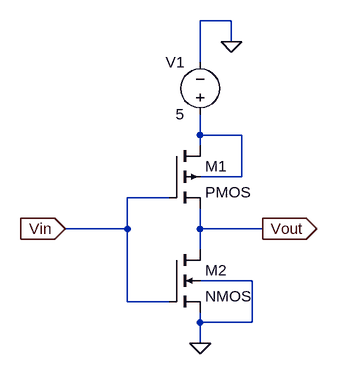
[diagram p0: schematic NotGate.asc]
NotGate.asc, the LTspice schematic file:
Version 4
SHEET 1 880 680
WIRE 224 -112 176 -112
WIRE 224 -80 224 -112
WIRE 176 -48 176 -112
WIRE 176 64 176 32
WIRE 240 64 176 64
WIRE 176 80 176 64
WIRE 240 128 240 64
WIRE 240 128 176 128
WIRE 128 160 64 160
WIRE 64 208 -32 208
WIRE 64 208 64 160
WIRE 176 208 176 176
WIRE 272 208 176 208
WIRE 176 240 176 208
WIRE 256 288 176 288
WIRE 64 320 64 208
WIRE 128 320 64 320
WIRE 176 352 176 336
WIRE 256 352 256 288
WIRE 256 352 176 352
WIRE 176 384 176 352
FLAG 224 -80 0
FLAG 176 384 0
FLAG -32 208 Vin
IOPIN -32 208 In
FLAG 272 208 Vout
IOPIN 272 208 Out
SYMBOL pmos4 128 80 R0
SYMATTR InstName M1
SYMATTR Value2 l=0.6u w=3.6u
SYMBOL nmos4 128 240 R0
SYMATTR InstName M2
SYMATTR Value2 l=0.6u w=3u
SYMBOL voltage 176 48 R180
WINDOW 0 24 96 Left 2
WINDOW 3 24 16 Left 2
WINDOW 123 0 0 Left 0
WINDOW 39 0 0 Left 0
SYMATTR InstName V1
SYMATTR Value 5

The netlist it stands for:
* NotGate.asc
M1 N001 Vin Vout N001 PMOS l=0.6u w=3.6u
M2 Vout Vin 0 0 NMOS l=0.6u w=3u
V1 N001 0 5
.model NMOS NMOS
.model PMOS PMOS
.lib standard.mos
.backanno
.end